# EAGLE design InstrDigitizer4 (EAGLE 8.5.2)

## Sheet 1 of 2
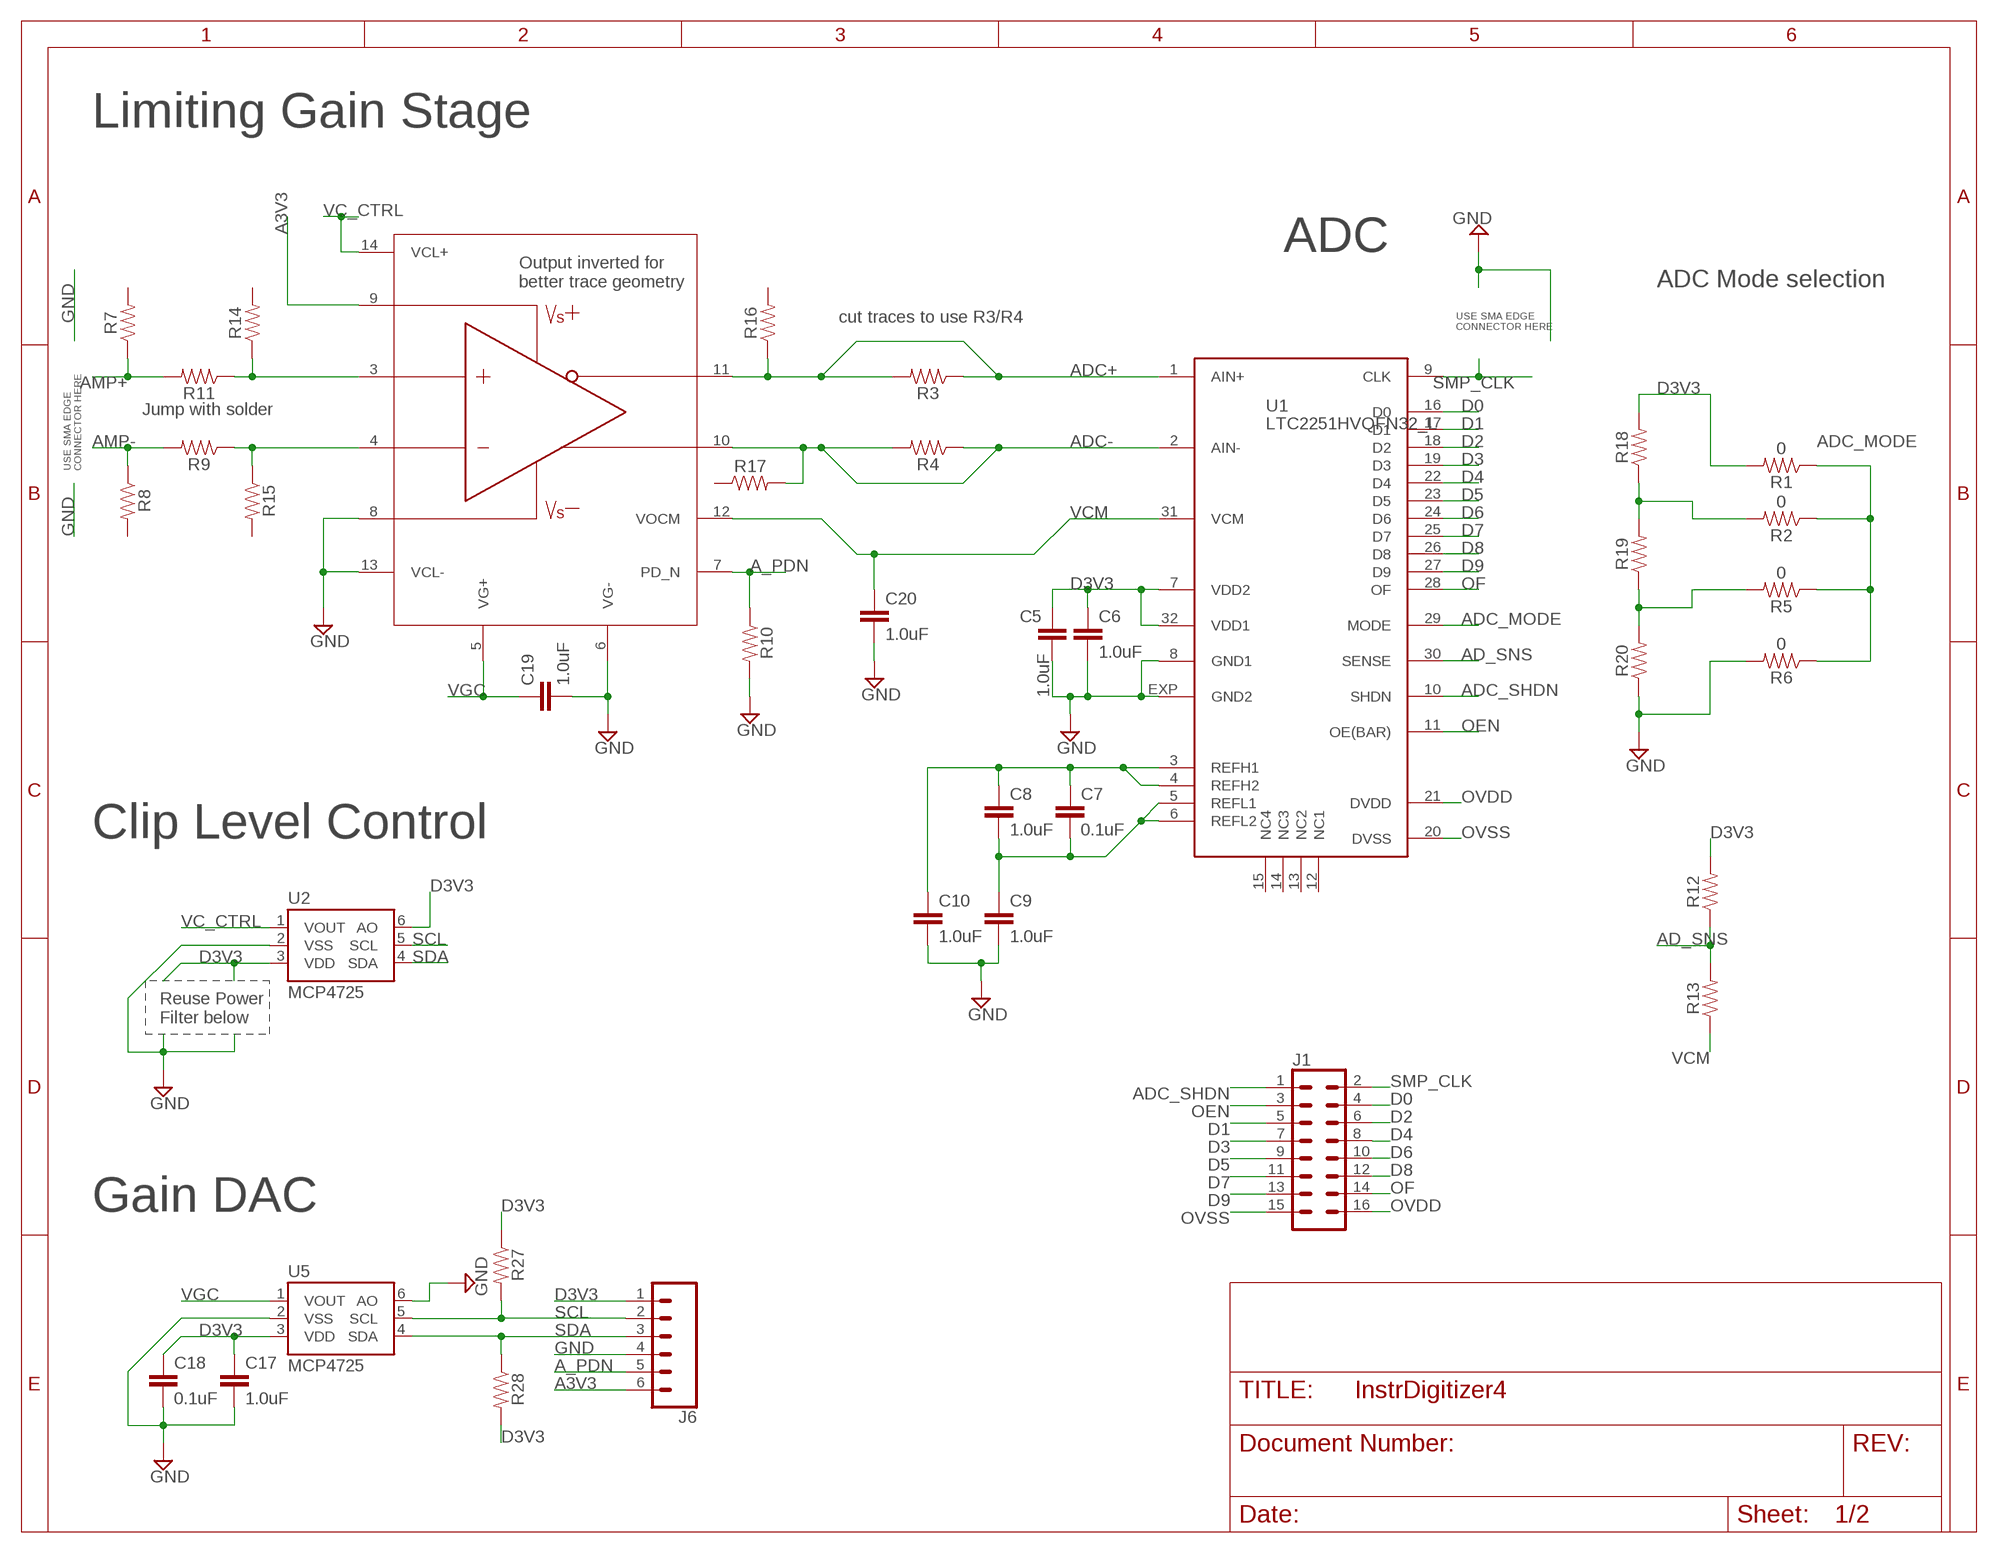
[diagram p0: schematic, sheet 1]

### Parts
C5  1.0uF  1.0UF-0402-16V-10%  [0402]
C6  1.0uF  1.0UF-0402-16V-10%  [0402]
C7  0.1uF  1.0UF-0402-16V-10%  [0402]
C8  1.0uF  1.0UF-0402-16V-10%  [0402]
C9  1.0uF  1.0UF-0402-16V-10%  [0402]
C10  1.0uF  1.0UF-0402-16V-10%  [0402]
C17  1.0uF  1.0UF-0402-16V-10%  [0402]
C18  0.1uF  0.1UF-0402-16V-10%  [0402]
C19  1.0uF  1.0UF-0402-16V-10%  [0402]
C20  1.0uF  1.0UF-0402-16V-10%  [0402]
J1  CONN_08X2  [2X8]
J6  CONN_06SILK_FEMALE_PTH  [1X06]
R1  0  RESISTOR0402  [0402]
R2  0  RESISTOR0402  [0402]
R3  RESISTOR0402  [0402]
R4  RESISTOR0402  [0402]
R5  0  RESISTOR0402  [0402]
R6  0  RESISTOR0402  [0402]
R7  RESISTOR0402  [0402]
R8  RESISTOR0402  [0402]
R9  RESISTOR0402  [0402]
R10  RESISTOR0402  [0402]
R11  RESISTOR0402  [0402]
R12  RESISTOR0402  [0402]
R13  RESISTOR0402  [0402]
R14  RESISTOR0402  [0402]
R15  RESISTOR0402  [0402]
R16  RESISTOR0402  [0402]
R17  RESISTOR0402  [0402]
R18  RESISTOR0402  [0402]
R19  RESISTOR0402  [0402]
R20  RESISTOR0402  [0402]
R27  RESISTOR0402  [0402]
R28  RESISTOR0402  [0402]
U1  LTC2251HVQFN32_L  [HVQFN32_LONG]
U2  MCP4725  MCP4725SOT-23  [SOT23-6]
U5  MCP4725  MCP4725SOT-23  [SOT23-6]
U$1  THS7530TSSOP14_LONG  [TSSOP14_LONG]

### Nets
A3V3: J6.6 U$1.9 ; also sheet 2
A_PDN: J6.5 R10.1 U$1.7(PD_N)
AD_SNS: R12.1 R13.2 U1.30(SENSE)
ADC+: R3.1 R3.2 R16.1 U1.1(AIN+) U$1.11(VO-)
ADC-: R4.1 R4.2 R17.2 U1.2(AIN-) U$1.10(VO+)
ADC_MODE: R1.1 R2.1 R5.1 R6.1 U1.29(MODE)
ADC_SHDN: J1.1 U1.10(SHDN)
AMP+: R7.1 R11.2
AMP-: R8.1 R9.2
D0: J1.4 U1.16(D0)
D1: J1.5 U1.17(D1)
D2: J1.6 U1.18(D2)
D3: J1.7 U1.19(D3)
D3V3: C5.1 C6.1 C17.1 C18.1 J6.1 R1.2 R12.2 R18.2 R27.1 R28.2 U1.7(VDD2) U1.32(VDD1) U2.3(VDD) U2.6(AO) U5.3(VDD) ; also sheet 2
D4: J1.8 U1.22(D4)
D5: J1.9 U1.23(D5)
D6: J1.10 U1.24(D6)
D7: J1.11 U1.25(D7)
D8: J1.12 U1.26(D8)
D9: J1.13 U1.27(D9)
GND: C5.2 C6.2 C9.2 C10.2 C17.2 C18.2 C19.2 C20.2 J6.4 R6.2 R10.2 R20.1 U1.8(GND1) U1.EXP(GND2) U2.2(VSS) U5.2(VSS) U5.6(AO) U$1.6(VG-) U$1.8 U$1.13(VCL-) ; also sheet 2
N$1: R11.1 R14.1 U$1.3
N$11: R9.1 R15.1 U$1.4
N$21: C7.1 C8.1 C10.1 U1.3(REFH1) U1.4(REFH2)
N$22: R5.2 R19.1 R20.2
N$23: C7.2 C8.2 C9.1 U1.5(REFL1) U1.6(REFL2)
N$30: R2.2 R18.1 R19.2
OEN: J1.3 U1.11(OE(BAR))
OF: J1.14 U1.28(OF)
OVDD: J1.16 U1.21(DVDD)
OVSS: J1.15 U1.20(DVSS)
SCL: J6.2 R27.2 U2.5(SCL) U5.5(SCL)
SDA: J6.3 R28.1 U2.4(SDA) U5.4(SDA)
SMP_CLK: J1.2 U1.9(CLK)
VC_CTRL: U2.1(VOUT) U$1.14(VCL+)
VCM: C20.1 R13.1 U1.31(VCM) U$1.12(VOCM)
VGC: C19.1 U5.1(VOUT) U$1.5(VG+)
Unconnected: R7.2 R8.2 R14.2 R15.2 R16.2 R17.1 U1.12(NC1) U1.13(NC2) U1.14(NC3) U1.15(NC4)

### Notes on the sheet
- Limiting Gain Stage
- ADC
- Output inverted for 
  better trace geometry
- ADC Mode selection
- cut traces to use R3/R4
- USE SMA EDGE 
  CONNECTOR HERE
- Jump with solder
- USE SMA EDGE 
  CONNECTOR HERE
- Clip Level Control
- Reuse Power
  Filter below
- Gain DAC

## Sheet 2 of 2
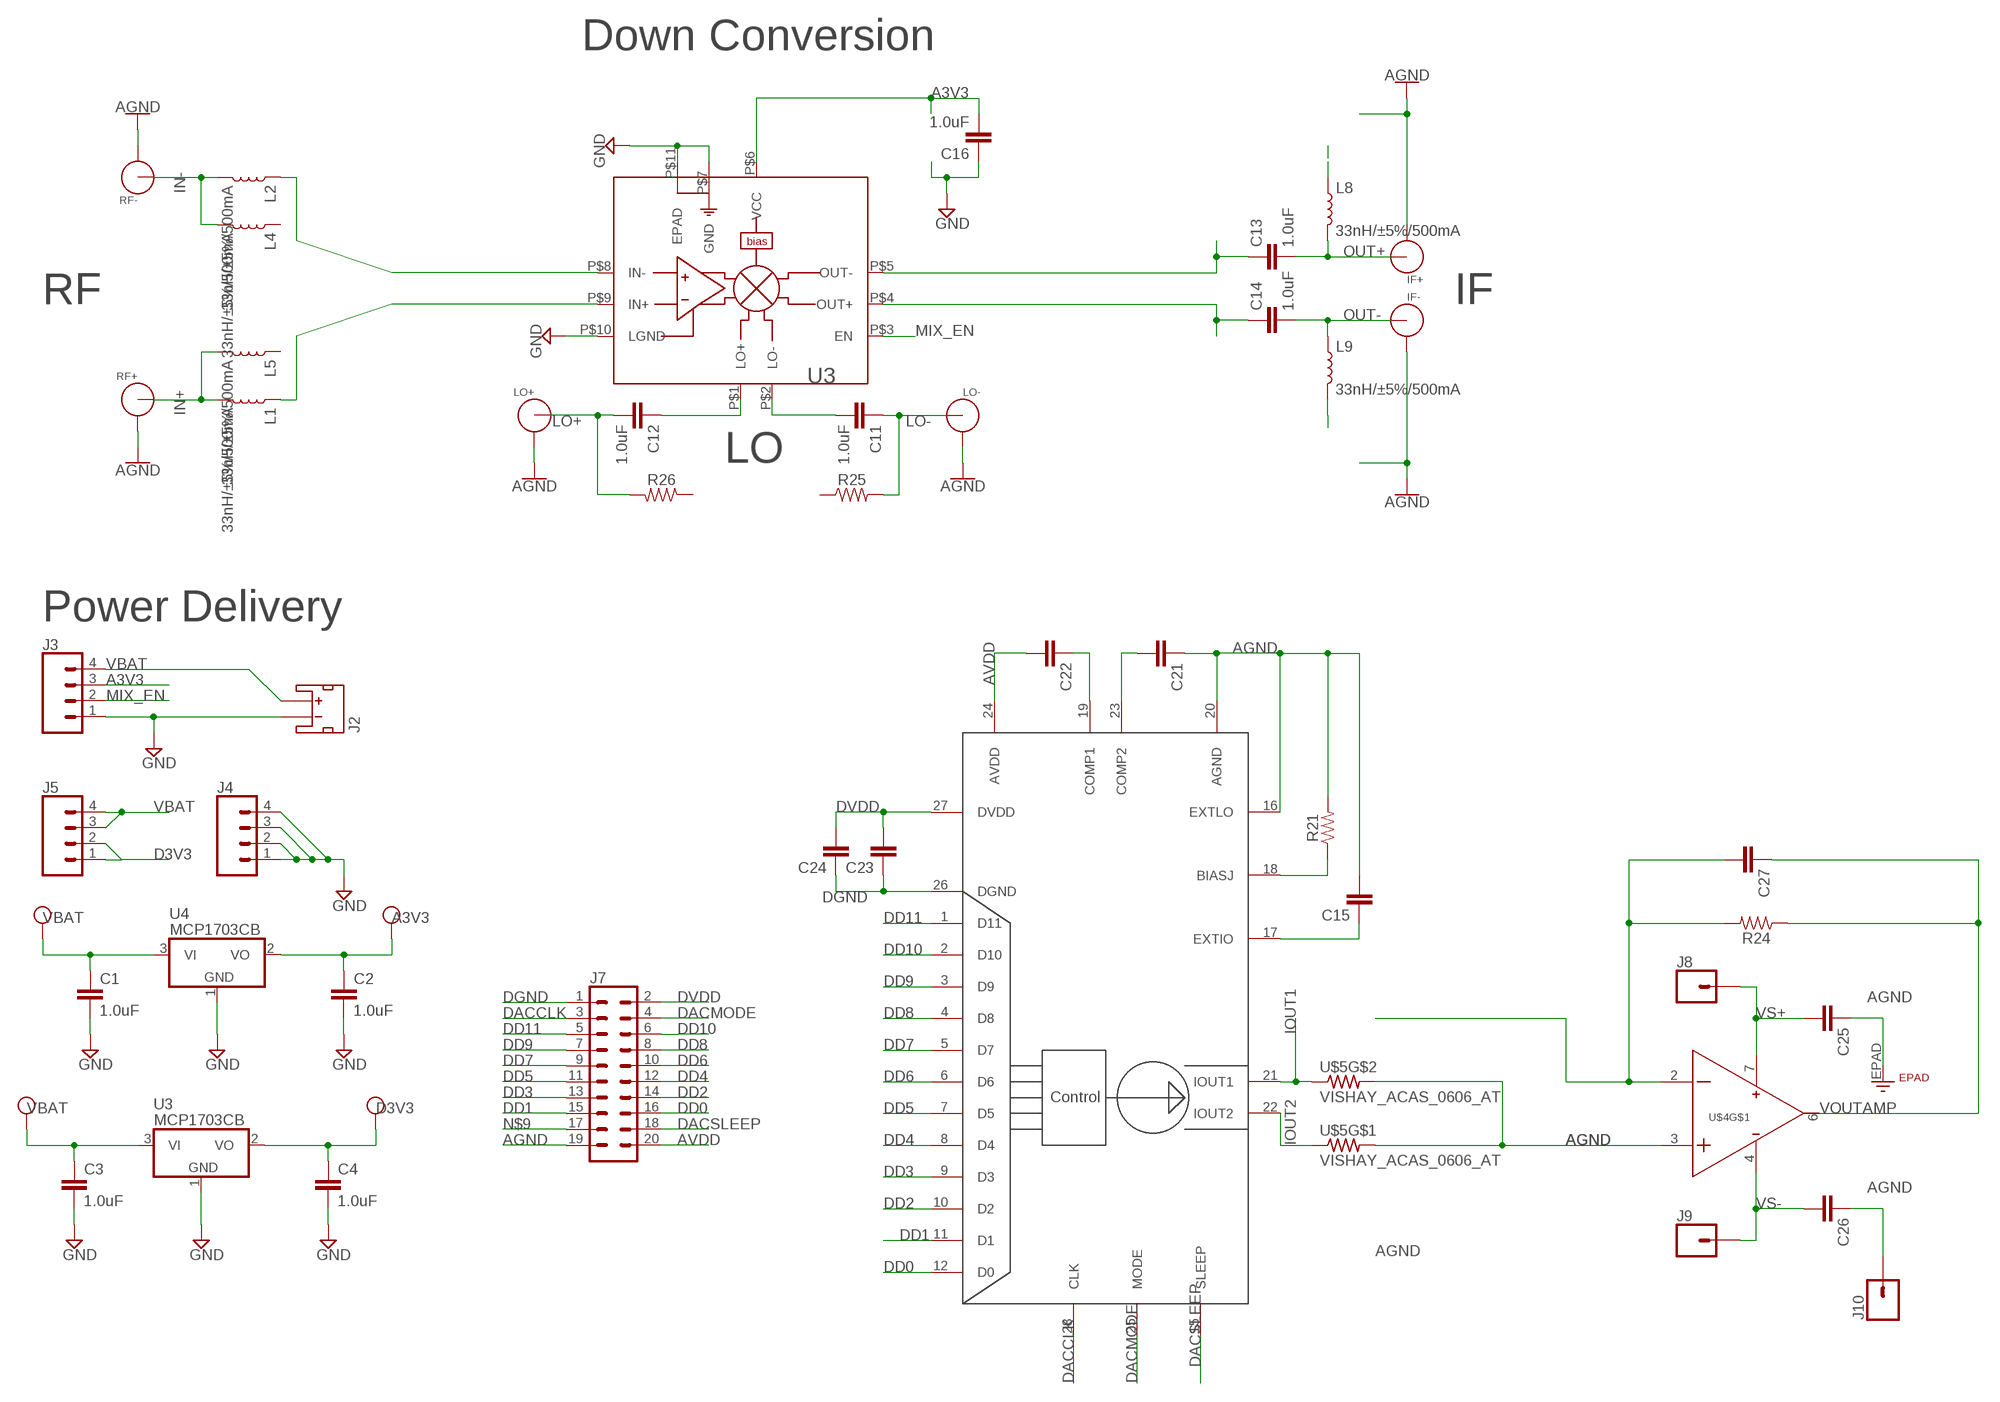
[diagram p1: schematic, sheet 2]

### Parts
C1  1.0uF  1.0UF-0402-16V-10%  [0402]
C2  1.0uF  1.0UF-0402-16V-10%  [0402]
C3  1.0uF  1.0UF-0402-16V-10%  [0402]
C4  1.0uF  1.0UF-0402-16V-10%  [0402]
C11  1.0uF  1.0UF-0402-16V-10%  [0402]
C12  1.0uF  1.0UF-0402-16V-10%  [0402]
C13  1.0uF  1.0UF-0402-16V-10%  [0402]
C14  1.0uF  1.0UF-0402-16V-10%  [0402]
C15  1.0UF-0402-16V-10%  [0402]
C16  1.0uF  1.0UF-0402-16V-10%  [0402]
C21  1.0UF-0402-16V-10%  [0402]
C22  1.0UF-0402-16V-10%  [0402]
C23  1.0UF-0402-16V-10%  [0402]
C24  1.0UF-0402-16V-10%  [0402]
C25  1.0UF-0402-16V-10%  [0402]
C26  1.0UF-0402-16V-10%  [0402]
C27  1.0UF-0402-16V-10%  [0402]
IF+  LINX-SMA-EDGE-0.062  [CONSMA003.062]
IF-  LINX-SMA-EDGE-0.062  [CONSMA003.062]
J2  JST_2MM_MALE  [JST-2-SMD]
J3  CONN_04  [1X04]
J4  CONN_04  [1X04]
J5  CONN_04  [1X04]
J7  CONN_10X2  [2X10]
J8  CONN_01  [1X01]
J9  CONN_01  [1X01]
J10  CONN_01  [1X01]
L1  33nH/±5%/500mA  INDUCTOR-0603-33NH  [0603]
L2  33nH/±5%/500mA  INDUCTOR-0603-33NH  [0603]
L4  33nH/±5%/500mA  INDUCTOR-0603-33NH  [0603]
L5  33nH/±5%/500mA  INDUCTOR-0603-33NH  [0603]
L8  33nH/±5%/500mA  INDUCTOR-0603-33NH  [0603]
L9  33nH/±5%/500mA  INDUCTOR-0603-33NH  [0603]
LO+  LINX-SMA-EDGE-0.062  [CONSMA003.062]
LO-  LINX-SMA-EDGE-0.062  [CONSMA003.062]
R21  RESISTOR0402  [0402]
R24  RESISTOR0402  [0402]
R25  RESISTOR0402  [0402]
R26  RESISTOR0402  [0402]
RF+  LINX-SMA-EDGE-0.062  [CONSMA003.062]
RF-  LINX-SMA-EDGE-0.062  [CONSMA003.062]
U3  MCP1703CB  [SOT23]
U4  MCP1703CB  [SOT23]
U$2  THS5661ASOIC28  [SOIC-28]
U$3  LTC5562LONG  [QFN_10_2X2MM_05-08-1534_LONG]
U$4  THS4011SOIC8-EPAD  [SO-08]
U$5  VISHAY_ACAS_0606_AT  [VISHAY_ACAS0606AT]

### Nets
A3V3: C2.1 C16.2 J3.3 U4.2(VO) U$3.P$6(VCC) ; supply symbol labelled VDD ; also sheet 1
AGND: C15.2 C21.1 C25.1 C26.1 J7.19 J10.1 R21.2 U$2.16(EXTLO) U$2.20(AGND) U$4.3(IN+) U$4.EPAD U$5.P$3 U$5.P$4
AVDD: C22.2 J7.20 U$2.24(AVDD)
D3V3: C4.1 J5.1 J5.2 U3.2(VO) ; supply symbol labelled VDD ; also sheet 1
DACCLK: J7.3 U$2.28(CLK)
DACMODE: J7.4 U$2.25(MODE)
DACSLEEP: J7.18 U$2.15(SLEEP)
DD0: J7.16 U$2.12(D0)
DD1: J7.15 U$2.11(D1)
DD2: J7.14 U$2.10(D2)
DD3: J7.13 U$2.9(D3)
DD4: J7.12 U$2.8(D4)
DD5: J7.11 U$2.7(D5)
DD6: J7.10 U$2.6(D6)
DD7: J7.9 U$2.5(D7)
DD8: J7.8 U$2.4(D8)
DD9: J7.7 U$2.3(D9)
DD10: J7.6 U$2.2(D10)
DD11: J7.5 U$2.1(D11)
DGND: C23.1 C24.1 J7.1 U$2.26(DGND)
DVDD: C23.2 C24.2 J7.2 U$2.27(DVDD)
GND: C1.2 C2.2 C3.2 C4.2 C16.1 IF+.GND1 IF+.GND2 IF+.GND3 IF+.GND4 IF-.GND1 IF-.GND2 IF-.GND3 IF-.GND4 J2.1(-) J3.1 J4.1 J4.2 J4.3 J4.4 LO+.GND1 LO+.GND2 LO+.GND3 LO+.GND4 LO-.GND1 LO-.GND2 LO-.GND3 LO-.GND4 RF+.GND1 RF+.GND2 RF+.GND3 RF+.GND4 RF-.GND1 RF-.GND2 RF-.GND3 RF-.GND4 U3.1(GND) U4.1(GND) U$3.P$7(GND) U$3.P$10(LGND) U$3.P$11(EPAD) ; supply symbol labelled AGND ; also sheet 1
IN+: L1.2 L5.2 RF+.ANT
IN-: L2.2 L4.2 RF-.ANT
IOUT1: U$2.21(IOUT1) U$5.P$2
IOUT2: U$2.22(IOUT2) U$5.P$1
LO+: C12.2 LO+.ANT R26.2
LO-: C11.1 LO-.ANT R25.2
MIX_EN: J3.2 U$3.P$3(EN)
N98: L1.1 U$3.P$9(IN+)
N$3: C15.1 U$2.17(EXTIO)
N$4: R21.1 U$2.18(BIASJ)
N$6: C21.2 U$2.23(COMP2)
N$7: C22.1 U$2.19(COMP1)
N$8: C27.2 R24.2 U$4.2(IN-)
N$9: J7.17
N$20: C11.2 U$3.P$2(LO-)
N$24: C12.1 U$3.P$1(LO+)
N$25: L2.1 U$3.P$8(IN-)
N$26: C14.1 U$3.P$4(OUT+)
N$27: C13.1 U$3.P$5(OUT-)
N$37: L8.1
N$38: L9.2
OUT+: C13.2 IF+.ANT L8.2
OUT-: C14.2 IF-.ANT L9.1
VBAT: C1.1 C3.1 J2.2(+) J3.4 J5.3 J5.4 U3.3(VI) U4.3(VI) ; supply symbol labelled VCC
VOUTAMP: C27.1 R24.1 U$4.6(OUT)
VS+: C25.2 J8.1 U$4.7(VCC+)
VS-: C26.2 J9.1 U$4.4(VCC-)
Unconnected: J2.NC1(PAD1) J2.NC2(PAD2) L4.1 L5.1 R25.1 R26.1

### Notes on the sheet
- Down Conversion
- RF | IF
- U3
- LO
- Power Delivery

## Library data of the parts
C1-C6 C8-C14 C16 C17 C19 C20 = SparkFun-Capacitors:1.0UF: 1µF ceramic capacitors A capacitor is a passive two-terminal electrical component used to store electrical energy temporarily in an electric field.; PROD_ID: CAP-12417
C7 C15 C21-C27 = SparkFun-Capacitors:1.0UF: 1µF ceramic capacitors A capacitor is a passive two-terminal electrical component used to store electrical energy temporarily in an electric field.; PROD_ID: CAP-12417; VALUE: 1.0uF
C18 = SparkFun-Capacitors:0.1UF: 0.1µF ceramic capacitors A capacitor is a passive two-terminal electrical component used to store electrical energy temporarily in an electric field.; PROD_ID: CAP-12416
IF+ IF- LO+ LO- RF+ RF- = connector:LINX-SMA-EDGE-0.062: CONN SMA JACK 50 OHM EDGE MNT; DIGIKEY: CONSMA003.062-ND
J1 = SparkFun-Connectors:CONN_08X2: Multi connection point. Often used as Generic Header-pin footprint for 0.1 inch spaced/style header connections You can populate with any combo of single row headers, but if you'd like an exact match, check this: Header - 2x8 (Male, 0.1") <https://www.sparkfun.com/products/13156> (PRT-13156) On any of the 0.1 inch spaced packages, you can populate with these: Break Away Headers - Straight <https://www.sparkfun.com/products/116> (PRT-00116) Break Away Male Headers - Right Angle <https://www.sparkfun.com/products/553> (PRT-00553) Female Headers <https://www.sparkfun.com/products/115> (PRT-00115) Break Away Headers - Machine Pin <https://www.sparkfun.com/products/117> (PRT-00117) Break Away Female Headers - Swiss Machine Pin <https://www.sparkfun.com/products/743> (PRT-00743)
J2 = SparkFun-Connectors:JST_2MM_MALE: JST 2MM MALE RA CONNECTOR Two pin, compact surface mount connector. Commonly used as a battery input connection point. We really like the solid locking feeling and high current rating on these small connectors. We use these all the time as battery connectors. Mates to single-cell LiPo batteries. Here is the connector we sell at SparkFun: JST Right Angle Connector - White <https://www.sparkfun.com/products/8612> (PRT-08612) Datasheet <http://www.sparkfun.com/datasheets/Prototyping/Connectors/JST-Horizontal.pdf> It was used on these SparkFun products: SparkFun MOSFET Power Controller <https://www.sparkfun.com/products/11214> (PRT-11214) SparkFun Battery Babysitter - LiPo Battery Manager <https://www.sparkfun.com/products/13777> (PRT-13777) And many, many others that required a lipo battery connection.; PROD_ID: CONN-11443; SF_ID: PRT-08612
J3-J5 = SparkFun-Connectors:CONN_04: Multi connection point. Often used as Generic Header-pin footprint for 0.1 inch spaced/style header connections On any of the 0.1 inch spaced packages, you can populate with these: Break Away Headers - Straight <https://www.sparkfun.com/products/116> (PRT-00116) Break Away Male Headers - Right Angle <https://www.sparkfun.com/products/553> (PRT-00553) Female Headers <https://www.sparkfun.com/products/115> (PRT-00115) Break Away Headers - Machine Pin <https://www.sparkfun.com/products/117> (PRT-00117) Break Away Female Headers - Swiss Machine Pin <https://www.sparkfun.com/products/743> (PRT-00743) For SCREWTERMINALS and SPRING TERMINALS visit here: Screw Terimnals on SparkFun.com <https://www.sparkfun.com/search/results?term=Screw+Terminals> (5mm/3.5mm/2.54mm spacing) This device is also useful as a general connection point to wire up your design to another part of your project. Our various solder wires solder well into these plated through hole pads. Hook-Up Wire - Assortment (Stranded, 22 AWG) <https://www.sparkfun.com/products/11375> (PRT-11375) Hook-Up Wire - Assortment (Solid Core, 22 AWG) <https://www.sparkfun.com/products/11367> (PRT-11367) View the entire wire category on our website here <https://www.sparkfun.com/categories/141> Special notes: Molex polarized connector foot print use with SKU : PRT-08231 with associated crimp pins and housings. 1MM SMD Version SKU: PRT-10208; PROD_ID: CONN-09696
J6 = SparkFun-Connectors:CONN_06: Multi connection point. Often used as Generic Header-pin footprint for 0.1 inch spaced/style header connections On any of the 0.1 inch spaced packages, you can populate with these: Break Away Headers - Straight <https://www.sparkfun.com/products/116> (PRT-00116) Break Away Male Headers - Right Angle <https://www.sparkfun.com/products/553> (PRT-00553) Female Headers <https://www.sparkfun.com/products/115> (PRT-00115) Break Away Headers - Machine Pin <https://www.sparkfun.com/products/117> (PRT-00117) Break Away Female Headers - Swiss Machine Pin <https://www.sparkfun.com/products/743> (PRT-00743) Arduino Stackable Header - 6 Pin <https://www.sparkfun.com/products/9280> (PRT-09280) For SCREWTERMINALS and SPRING TERMINALS visit here: Screw Terimnals on SparkFun.com <https://www.sparkfun.com/search/results?term=Screw+Terminals> (5mm/3.5mm/2.54mm spacing) This device is also useful as a general connection point to wire up your design to another part of your project. Our various solder wires solder well into these plated through hole pads. Hook-Up Wire - Assortment (Stranded, 22 AWG) <https://www.sparkfun.com/products/11375> (PRT-11375) Hook-Up Wire - Assortment (Solid Core, 22 AWG) <https://www.sparkfun.com/products/11367> (PRT-11367) View the entire wire category on our website here <https://www.sparkfun.com/categories/141>; PROD_ID: CONN-08437
J7 = SparkFun-Connectors:CONN_10X2: Multi connection point. Often used as Generic Header-pin footprint for 0.1 inch spaced/style header connections On any of the 0.1 inch spaced packages, you can populate with these: Break Away Headers - Straight <https://www.sparkfun.com/products/116> (PRT-00116) Break Away Male Headers - Right Angle <https://www.sparkfun.com/products/553> (PRT-00553) Female Headers <https://www.sparkfun.com/products/115> (PRT-00115) Break Away Headers - Machine Pin <https://www.sparkfun.com/products/117> (PRT-00117) Break Away Female Headers - Swiss Machine Pin <https://www.sparkfun.com/products/743> (PRT-00743) Special note about the "SPECIAL" package: This was SPECIALLY designed to be used with our Graphic LCD Backpack. Be sure you want to use this! It is not only staggered on each line of header holes, but IT IS ALSO offset of the center point of the top and bottom lines by 5 mil. This causes the headers to lock into place on the "standard" footprint on the LCD screen. The extra squares on the tdocu layer are there simply to reference other pins (if you were to actually populate a longer header than ten long - this is what we do with the backpacks).
J8-J10 = SparkFun-Connectors:CONN_01: Single connection point. Often used as Generic Header-pin footprint for 0.1 inch spaced/style header connections On any of the 0.1 inch spaced packages, you can populate with these: Break Away Headers - Straight <https://www.sparkfun.com/products/116> (PRT-00116) Break Away Male Headers - Right Angle <https://www.sparkfun.com/products/553> (PRT-00553) Female Headers <https://www.sparkfun.com/products/115> (PRT-00115) Break Away Headers - Machine Pin <https://www.sparkfun.com/products/117> (PRT-00117) Break Away Female Headers - Swiss Machine Pin <https://www.sparkfun.com/products/743> (PRT-00743) This device is also useful as a general connection point to wire up your design to another part of your project. Our various solder wires solder well into these plated through hole pads. Hook-Up Wire - Assortment (Stranded, 22 AWG) <https://www.sparkfun.com/products/11375> (PRT-11375) Hook-Up Wire - Assortment (Solid Core, 22 AWG) <https://www.sparkfun.com/products/11367> (PRT-11367) View the entire wire category on our website here <https://www.sparkfun.com/categories/141> Special notes: SMTSO-256-ET is a "flush mount" nut for a 4-40 screw. We mostly use this on specialty testbeds; it is a nice way to connect hardware to your PCB at an adjustable hieght. Also note, the SNAP packages are for using a snappable style connector. We sell a baggie of snaps and they are also used on two LilyPad designs: Snap Assortment - 30 pack (male and female) <https://www.sparkfun.com/products/11347> (DEV-11347) LilyPad Arduino SimpleSnap <https://www.sparkfun.com/products/10941> (DEV-10941) LilyPad SimpleSnap Protoboard <https://www.sparkfun.com/products/10940> (DEV-10940)
L1 L2 L4 L5 L8 L9 = SparkFun-Coils:INDUCTOR: Inductors Resist changes in electrical current. Basically a coil of wire. SparkFun Products: SparkFun Load Cell Amplifier - HX711 <https://www.sparkfun.com/products/13879> IOIO-OTG - V2.2 <https://www.sparkfun.com/products/13613>; PROD_ID: NDUC-07874
R1-R21 R24-R28 = SparkFun-Resistors:RESISTOR: Generic Resistor Package
U1 = components:LTC2251: LTC2251 125MSPS Pipelined ADC
U2 U5 = SparkFun-IC-Conversion:MCP4725: MCP4725 DAC Microchip 12-bit I2C DAC, SOT23-6 Datasheet <https://cdn.sparkfun.com/datasheets/BreakoutBoards/MCP4725_2009.pdf> SparkFun Products SparkFun I2C DAC Breakout - MCP4725 <https://www.sparkfun.com/products/12918> (BOB-12918); PROD_ID: IC-08886
U3 U4 = linear:MCP1703: 250 mA, 16V, Low Quiescent Current LDO Regulator Source: http://ww1.microchip.com/downloads/en/DeviceDoc/22049b.pdf
U$1 = components:THS7530
U$2 = components:THS5661A
U$3 = components:LTC5562: LF–7GHz Wideband Low Power Active Mixer Wideband Frequency Range to 7GHz Low Power: 2.7V to 3.6V, 40mA Supply Supply Current Adjustable Down to 15mA Up or Downconversion OIP3: +20dBm at 3.6GHz Out Conversion Gain: +1dB Low LO Drive: –4dBm to +2dBm LO Impedance Match Maintained During Shutdown Enable Control, 10μA Shutdown Current 2kV ESD (HBM and CDM) –40°C to 105°C Operation Small 2mm × 2mm 10-Lead QFN Package
U$4 = components:THS4011
U$5 = components:VISHAY_ACAS_0606_AT

## Board
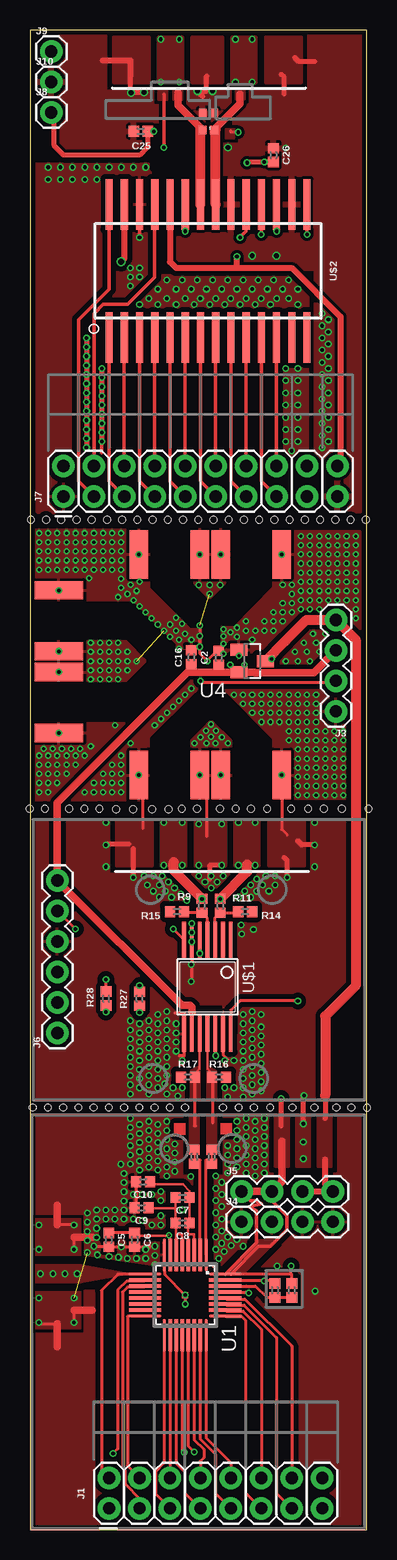
[diagram p2: board, top side]
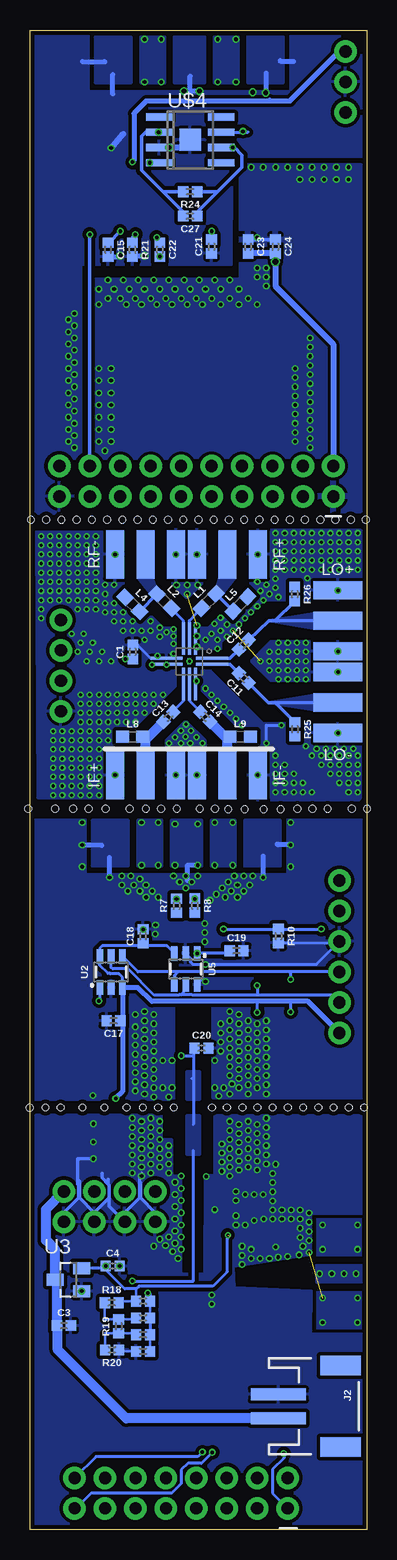
[diagram p3: board, bottom side, seen from below]

Size 28.11 x 124.98 mm. Coordinates in mm from the lower left corner, seen from the top.
Outline: 0,0 28.11,0 28.11,124.98 0,124.98 0,0
Copper layers (1*16): Top 0.0356mm / dielectric 60mil / Bottom 0.0356mm
Design rules "OSHPARK": minimum track width 6mil, minimum drill 10mil, track to track 6mil, track to pad 6mil, pad to pad 6mil, via to via 6mil, smd to smd 0mil, copper to edge 15mil, drill to drill 10mil, minimum pad ring 5mil, minimum via ring 5mil, stop-mask expansion 4mil, vias tented up to drill 20mil, thermal gap 10mil
Holes 0.55 mm at 16.1,35.18 18.69,35.18 12.93,35.18 11.66,35.18 10.39,35.18 9.12,35.18 26.82,35.18 7.85,35.18 6.58,35.18 5.31,35.18 25.55,35.18 23.72,35.18 21.89,35.18 20.04,35.18 28.12,35.15 8.61,60.05 17.42,35.18 4.04,35.18 2.77,35.18 1.5,35.18 0.23,35.18 15.85,60.07 18.44,60.07 13.94,60.07 11.56,60.05 10.19,60.05 5.79,60.07 4.55,60.07 3.28,60.07 24.51,60.07 23.22,60.07 21.79,60.07 19.79,60.07 26.01,60.07 17.17,60.07 7.19,60.05 1.24,60.07 -0.03,60.07 28.24,60.07 12.67,60.07 8.97,84.18 7.7,84.18 6.43,84.18 5.16,84.18 3.89,84.18 2.62,84.18 1.35,84.18 0.08,84.18 19.13,84.18 17.86,84.18 16.59,84.18 15.32,84.18 14.05,84.18 12.78,84.18 11.51,84.18 10.24,84.18 28.02,84.18 26.75,84.18 25.48,84.18 24.21,84.18 22.94,84.18 21.67,84.18 20.4,84.18

### Footprints (pad centres in the part's own frame; a part is rotated, then mirrored left to right if it is on the bottom)
0402 = smd 0.85 x 0.9: 1 -0.58,0; 2 0.58,0
CONSMA003.062 = smd 4.06 x 1.52: ANT 0,0; GND1 0,2.54; GND2 0,-2.54 | smd 4.06 x 1.52 bottom: GND3 0,2.54; GND4 0,-2.54
2X8 = drill 1.016 pad 1.88: 1 0,0; 2 0,2.54; 3 2.54,0; 4 2.54,2.54; 5 5.08,0; 6 5.08,2.54; 7 7.62,0; 8 7.62,2.54; 9 10.16,0; 10 10.16,2.54; 11 12.7,0; 12 12.7,2.54; 13 15.24,0; 14 15.24,2.54; 15 17.78,0; 16 17.78,2.54
JST-2-SMD = smd 1 x 4.6: 1 -1,-3.7; 2 1,-3.7 | smd 1.6 x 3.4: NC1 -3.4,1.5; NC2 3.4,1.5
1X04 = drill 1.016 pad 1.88: 1 0,0; 2 2.54,0; 3 5.08,0; 4 7.62,0
1X06 = drill 1.016 pad 1.88: 1 0,0; 2 2.54,0; 3 5.08,0; 4 7.62,0; 5 10.16,0; 6 12.7,0
2X10 = drill 1.016 pad 1.88: 1 0,0; 2 0,2.54; 3 2.54,0; 4 2.54,2.54; 5 5.08,0; 6 5.08,2.54; 7 7.62,0; 8 7.62,2.54; 9 10.16,0; 10 10.16,2.54; 11 12.7,0; 12 12.7,2.54; 13 15.24,0; 14 15.24,2.54; 15 17.78,0; 16 17.78,2.54; 17 20.32,0; 18 20.32,2.54; 19 22.86,0; 20 22.86,2.54
1X01 = drill 1.016 pad 1.88: 1 0,0
0603 = smd 1.1 x 1: 1 -0.85,0; 2 0.85,0
HVQFN32_LONG = smd 2.7 x 0.28: 1 -3.35,1.75; 2 -3.35,1.25; 3 -3.35,0.75; 4 -3.35,0.25; 5 -3.35,-0.25; 6 -3.35,-0.75; 7 -3.35,-1.25; 8 -3.35,-1.75; 17 3.35,-1.75; 18 3.35,-1.25; 19 3.35,-0.75; 20 3.35,-0.25; 21 3.35,0.25; 22 3.35,0.75; 23 3.35,1.25; 24 3.35,1.75 | smd 0.28 x 2.7: 9 -1.75,-3.35; 10 -1.25,-3.35; 11 -0.75,-3.35; 12 -0.25,-3.35; 13 0.25,-3.35; 14 0.75,-3.35; 15 1.25,-3.35; 16 1.75,-3.35; 25 1.75,3.35; 26 1.25,3.35; 27 0.75,3.35; 28 0.25,3.35; 29 -0.25,3.35; 30 -0.75,3.35; 31 -1.25,3.35; 32 -1.75,3.35 | smd 0.5 x 0.5: EXP 0,0 | smd 0.25 x 0.25: M1 -2.415,2.415
SOT23-6 = smd 0.55 x 1.2: 1 0.95,1.3; 2 0,1.3; 3 -0.95,1.3; 4 -0.95,-1.3; 5 0,-1.3; 6 0.95,-1.3
SOT23 = smd 1 x 1.4: 1 -0.95,-1.1; 2 0.95,-1.1; 3 0,1.1
TSSOP14_LONG = smd 0.305 x 3: 1 -1.95,-3.918; 2 -1.3,-3.918; 3 -0.65,-3.918; 4 0,-3.918; 5 0.65,-3.918; 6 1.3,-3.918; 7 1.95,-3.918; 8 1.95,3.918; 9 1.3,3.918; 10 0.65,3.918; 11 0,3.918; 12 -0.65,3.918; 13 -1.3,3.918; 14 -1.95,3.918
SOIC-28 = smd 0.6 x 4.2: 1 8.89,5.548; 2 7.62,5.548; 3 6.35,5.548; 4 5.08,5.548; 5 3.81,5.548; 6 2.54,5.548; 7 1.27,5.548; 8 0,5.548; 9 -1.27,5.548; 10 -2.54,5.548; 11 -3.81,5.548; 12 -5.08,5.548; 13 -6.35,5.548; 14 -7.62,5.548; 15 -7.62,-5.548; 16 -6.35,-5.548; 17 -5.08,-5.548; 18 -3.81,-5.548; 19 -2.54,-5.548; 20 -1.27,-5.548; 21 0,-5.548; 22 1.27,-5.548; 23 2.54,-5.548; 24 3.81,-5.548; 25 5.08,-5.548; 26 6.35,-5.548; 27 7.62,-5.548; 28 8.89,-5.548
QFN_10_2X2MM_05-08-1534_LONG = smd 0.25 x 2.7: P$1 -0.25,1.9; P$2 0.25,1.9; P$6 0.25,-1.9; P$7 -0.25,-1.9 | smd 2.7 x 0.25: P$3 1.9,0.5; P$4 1.9,0; P$5 1.9,-0.5; P$8 -1.9,-0.5; P$9 -1.9,0; P$10 -1.9,0.5 | smd 0.5 x 0.3: P$11 0,0
SO-08 = smd 0.6 x 2.2: 1 -1.905,-2.6; 2 -0.635,-2.6; 3 0.635,-2.6; 4 1.905,-2.6; 5 1.905,2.6; 6 0.635,2.6; 7 -0.635,2.6; 8 -1.905,2.6 | smd 1.829 x 1.829: EPAD 0,0
VISHAY_ACAS0606AT = smd 0.64 x 0.7: P$1 -0.47,-0.7; P$2 0.47,-0.7; P$3 0.47,0.7; P$4 -0.47,0.7

### Placement (x,y rotation side)
C1  19.52,73.15 90 bottom
C2  15.75,72.67 90 top
C3  25.27,17.02 0 bottom
C4  21.21,21.97 0 bottom
C5  6.58,24.15 270 top
C6  8.74,24.15 270 top
C7  12.73,27.68 180 top
C8  12.73,25.56 180 top
C9  9.3,26.83 180 top
C10  9.43,28.99 180 top
C11  10.26,70.97 135 bottom
C12  10.26,73.76 45 bottom
C13  16.56,67.74 225 bottom
C14  13.49,67.74 315 bottom
C15  21.59,106.68 270 bottom
C16  13.46,72.72 270 top
C17  21.14,42.42 180 bottom
C18  18.67,49.46 90 bottom
C19  10.87,48.26 0 bottom
C20  13.79,40.13 0 bottom
C21  12.95,106.93 90 bottom
C22  17.27,106.68 270 bottom
C23  9.91,106.93 270 bottom
C24  7.62,106.93 270 bottom
C25  9.25,116.54 0 top
C26  20.32,114.55 270 top
C27  14.73,109.47 180 bottom
IF+  18.47,62.89 90 bottom
IF-  11.63,62.89 270 bottom
J1  6.6,1.78 0 top
J2  3.68,10.29 270 bottom
J3  25.53,68.2 90 top
J4  17.65,25.65 0 top
J5  17.65,28.19 0 top
J6  2.29,41.4 90 top
J7  2.79,86.11 0 top
J8  1.78,118.11 0 top
J9  1.78,123.19 0 top
J10  1.78,120.65 0 top
L1  13.19,77.39 45 bottom
L2  16.89,77.38 135 bottom
L4  19.56,77.11 315 bottom
L5  10.54,77.14 225 bottom
L8  19.53,66.07 0 bottom
L9  10.57,66.09 0 bottom
LO+  2.41,75.74 0 bottom
LO-  2.41,68.94 180 bottom
R1  18.67,19.05 180 bottom
R2  18.67,17.65 180 bottom
R3  15.16,31.09 270 top
R4  13.72,31.09 90 top
R5  18.67,16.26 180 bottom
R6  18.67,14.86 180 bottom
R7  15.88,51.99 270 bottom
R8  14.35,52.02 270 bottom
R9  14.35,52 90 top
R10  7.37,49.48 270 bottom
R11  15.88,52 90 top
R12  21.84,19.94 90 top
R13  20.45,19.94 270 top
R14  17.96,51.51 0 top
R15  12.27,51.51 180 top
R16  15.77,37.72 0 top
R17  13.18,37.72 0 top
R18  21.28,18.92 0 bottom
R19  20.7,16.95 90 bottom
R20  21.26,14.99 180 bottom
R21  19.56,106.68 270 bottom
R24  14.73,111.51 180 bottom
R25  5.99,66.7 90 bottom
R26  6.02,77.97 270 bottom
R27  9.14,44.25 90 top
R28  6.35,44.27 270 top
RF+  11.63,81.28 270 bottom
RF-  18.47,81.28 90 bottom
U1  12.95,19.56 270 top
U2  21.34,46.48 180 bottom
U3  24.89,20.83 90 bottom
U4  18.54,72.39 270 top
U5  15.11,46.74 0 bottom
U$1  14.81,45.24 180 top
U$2  15.49,104.9 180 top
U$3  14.81,72.36 270 bottom
U$4  14.73,115.82 270 bottom
U$5  14.88,117.35 0 top

### Tracks (layer width: path | path; a pad name or v marks a point on that pad's centre or on a via)
A3V3  (via drill 0.25)
  Top 0.254: 13.51,43.08 13.51,43.01 U$1.9 | C16.2 13.15,71.82 13.15,71.44 | v17.91,72.08 17.44,71.62 | 17.44,71.62 U4.2 | v16.71,72.08 17.17,71.62 17.44,71.62 | 15.75,71.44 C2.1
  Top 0.61: 13.51,43.08 13.51,43.56 13.34,43.69 12.7,43.69 J6.6 2.29,60.58 13.15,71.44 15.75,71.44 U4.2 18.75,71.44 18.75,71.43 23.68,71.43 J3.3
  Bottom 0.254: v16.71,72.08 U$3.P$6 17.88,72.11 v17.91,72.08
A_PDN  (via drill 0.3)
  Top 0.254: U$1.7 v11.96,50.05 | v3.79,50.05 J6.5
  Bottom 0.254: v11.96,50.05 R10.1 v3.79,50.05
AD_SNS
  Top 0.254: U1.30 18.03,20.31 18.81,20.31 19.76,19.36 R13.2 R12.1
ADC+
  Top 0.152: R3.1 R3.2
  Top 0.203: U$1.11 14.81,38.41 15.24,37.97 | 15.24,31.75 R3.1
  Top 0.254: U1.1 14.7,30.81 R3.2 | 15.24,37.97 15.24,33.91
  pour Top (no thermals): 14.81,31.75 15.52,31.75 15.52,34.54 14.81,34.54
  pour Top (no thermals): 14.81,35.81 15.52,35.81 15.52,38.23 14.81,38.61
ADC-
  Top 0.152: R4.2 R4.1
  Top 0.203: U$1.10 14.16,38.41 13.72,37.97
  Top 0.254: U1.2 14.2,30.81 R4.1 | 13.72,37.97 13.72,33.66 13.84,33.66
  pour Top (no thermals): 13.36,31.75 14.07,31.75 14.07,34.54 13.36,34.54
  pour Top (no thermals): 13.44,35.84 14.15,35.84 14.15,38.63 13.44,38.25
ADC_MODE  (via drill 0.3)
  Top 0.254: U1.29 18,19.81 v18.26,19.72
  Bottom 0.203: R2.1 R1.1 | R6.1 R5.1
  Bottom 0.254: v18.26,19.72 18.09,19.72 R1.1 | R2.1 R5.1
ADC_SHDN  (via drill 0.3)
  Top 0.254: U1.10 9.52,20.73 8.06,20.73 7.32,19.98 7.32,6.73 v6.93,6.35
  Bottom 0.254: v6.93,6.35 6.93,5.97 7.87,5.03 7.87,3.05 J1.1
AGND  (via drill 0.3, 0.4)
  Top 0.406: 8.38,119.63 8.38,121.16 8.38,122.05 | 23.75,122.35 22.43,122.35 22.1,122.68 | 21.21,119.63 21.21,121.03 20.95,121.28 | v8.43,119.76 8.46,119.79 v9.53,119.79 | 14.41,119.44 v13.97,119.89 14.73,119.89 14.73,121.16
  Top 0.508: 8.38,121.16 8.38,122.43 6.1,122.43
  Bottom 0.406: 6.1,122.35 7.16,122.35 7.24,122.43 | 8.38,119.63 8.38,119.89 | 8.38,119.89 8.38,121.41 | 21.21,119.63 21.21,121.28 | 23.75,122.35 21.89,122.35 21.84,122.3 | U$4.3 v16.51,115.19 | 8.38,119.89 8.43,119.84 v8.43,119.76 | v13.97,119.89 v15.24,119.89 14.73,119.89 14.73,121.16 | R21.2 19.49,106.17 v18.54,106.17 | C15.2 20.65,106.1 v20.57,106.17
  Bottom 0.508: v16.51,115.19 15.37,115.19 U$4.EPAD | v21.34,115.13 20.32,116.33
  other vias: 24.38,101.35 24.38,100.33 24.38,99.31 24.38,98.3 24.38,97.28 24.38,96.27 24.38,95.25 24.38,94.23 24.38,93.22 24.38,92.2 24.38,91.19 24.38,90.17 24.89,100.84 24.89,99.82 24.89,98.81 24.89,97.79 24.89,96.77 24.89,95.76 24.89,94.74 24.89,93.73 24.89,92.71 24.89,91.69 24.89,90.68
  pour Bottom (isolate 0.305): 6.99,124.43 6.99,120.55 9.93,120.55 9.93,124.43
  pour Top (isolate 0.406): 9.93,124.43 9.93,120.55 6.99,120.55 6.99,124.43
  pour Top (isolate 0.406): 22.63,124.43 22.63,120.55 19.68,120.55 19.68,124.43
  pour Bottom (isolate 0.406): 19.68,124.43 19.68,120.55 22.63,120.55 22.63,124.43
  pour Bottom (isolate 0.305, rank 2): 0,124.46 -0.03,114.43 11.15,114.43 11.3,112.83 11.33,105.41 23.88,105.41 23.88,83.82 27.94,83.82 27.94,105.16 27.69,124.46 23.24,124.46 23.24,119.89 6.35,119.89 6.35,124.46
  pour Top (isolate 0.254, rank 2): 0,124.46 0,114.43 11.3,114.43 11.3,105.16 23.88,105.16 23.88,83.82 27.94,83.82 27.94,124.46 23.37,124.46 23.37,119.76 6.22,119.76 6.22,124.46
  pour Top (isolate 0.406): 13.54,124.43 16.05,124.43 16.05,120.55 13.54,120.55
  pour Bottom (isolate 0.406): 16.05,124.43 13.54,124.43 13.54,120.55 16.05,120.55
AMP+  (via drill 0.3)
  Top 0.254: R11.2 R7.1
  Top 0.813: R11.2 18.11,54.81 18.11,55.42
  other vias: 17.4,58.93 18.8,58.93 18.8,55.37 17.4,55.37 15.88,52.57
  pour Top (isolate 0.406): 19.1,59.16 19.1,55.27 17.12,55.27 17.12,59.16
  pour Bottom (isolate 0.406): 17.12,59.16 17.12,55.27 19.1,55.27 19.1,59.16
AMP+1  (via drill 0.3)
  other vias: 17.14,124.21 18.54,124.21 18.54,120.65 17.14,120.65
  pour Top: 18.85,124.43 18.85,120.55 16.87,120.55 16.87,124.43
  pour Bottom: 16.87,124.43 16.87,120.55 18.85,120.55 18.85,124.43
AMP-  (via drill 0.3)
  Top 0.813: R9.2 11.99,54.94 11.99,55.63
  Bottom 0.254: R8.1 R9.2
  other vias: 11.18,58.93 12.7,58.93 12.7,55.37 11.18,55.37 14.35,52.58
  pour Top (isolate 0.406): 12.98,59.16 12.98,55.27 11,55.27 11,59.16
  pour Bottom (isolate 0.406): 11,59.16 11,55.27 12.98,55.27 12.98,59.16
AMP-1  (via drill 0.3)
  other vias: 10.92,124.21 12.45,124.21 12.45,120.65 10.92,120.65
  pour Top: 12.73,124.43 12.73,120.55 10.74,120.55 10.74,124.43
  pour Bottom: 10.74,124.43 10.74,120.55 12.73,120.55 12.73,124.43
AVDD  (via drill 0.3)
  Top 0.508: U$2.24 11.68,105.66 12.19,105.16 17.27,105.16 | 17.27,105.16 21.84,105.16 25.91,101.09 25.91,88.9 J7.20 | 17.27,105.16 C22.2
  other vias: 17.27,106.1
D0
  Top 0.254: U1.16 8.16,17.81 8.13,17.78 8.13,5.33 J1.4
D1
  Top 0.254: U1.17 11.2,5.56 10.46,4.82 10.46,3 J1.5
D2
  Top 0.254: U1.18 11.7,4.34 J1.6
D3
  Top 0.254: U1.19 12.2,7.59 12.2,5.53 12.9,4.82 12.9,3.1 J1.7
D3V3  (via drill 0.25, 0.3)  (1 unrouted)
  Top 0.203: 11.7,24.22 11.41,24.51 11,24.51 8.74,24.51 C6.1 | R27.1 v9.14,43.11 | v6.35,43.16 R28.2
  Top 0.254: C6.1 C5.1 | R12.2 21.84,21.31 | 21.84,21.31 16.76,21.31 U1.32 | 21.84,21.31 21.79,21.36 C4.1 | 11.68,22.93 U1.7 11.7,24.43 v11.59,24.55
  Top 0.305: 17.65,27.41 J5.1 18.41,27.43 18.8,27.43 19.3,27.18 18.29,26.92 18.9,26.57 18.9,23.9 U1.32 | J5.2 20.19,27.41 21.44,26.17 21.44,24.99 20.07,23.62 19.08,23.62 16.76,21.31
  Top 0.406: v20.95,35.94 20.95,33.66
  Top 0.61: 21.01,32.38 21.01,29.01 J5.2 J5.1
  Bottom 0.203: R18.2 20.7,19.05 R1.2 19.25,20.07 19.3,20.07
  Bottom 0.254: U5.3 16.69,48.66 18.67,48.66 | 18.67,48.66 22.08,48.66 22.29,48.45 U2.6 22.29,47.05 21.59,46.35 21.4,46.35 21.38,46.33 20.68,46.33 20.39,46.04 U2.3 20.39,42.59 C17.1 | v6.35,43.16 6.35,44.02 | v9.14,43.11 9.14,44.02 | U3.2 21.98,21.78 C4.1 21.79,21.66 20.19,20.07 19.3,20.07 | C18.1 18.67,48.66 | 19.25,20.07 19.01,20.31 12.84,20.31 11.68,21.46 11.68,24.45 v11.59,24.55
  Bottom 0.406: J6.1 4.91,44.02 6.35,44.02 9.14,44.02 17.96,44.02 19.11,45.18 U2.3 20.39,36.51 v20.95,35.94
  other vias: 21.79,21.97
  pour Top: 20.45,34.54 21.59,34.54 21.59,30.23 20.45,30.23
  pour Top (isolate 0.406, no thermals): 16.26,21.34 19.05,24.13 20.57,24.13 17.78,21.34
D4
  Top 0.254: U1.22 13.7,7.5 14.5,6.7 14.5,6 14.22,5.72 J1.8
D5
  Top 0.254: U1.23 14.2,7.57 15.49,6.29 15.49,3.06 J1.9
D6
  Top 0.254: U1.24 14.7,7.65 16.76,5.59 J1.10
D7
  Top 0.254: U1.25 17.62,17.81 17.98,17.45 17.98,3.1 J1.11
D8
  Top 0.254: U1.26 16.39,18.23 17.78,18.23 19.3,16.7 J1.12
D9
  Top 0.254: U1.27 16.39,18.73 17.86,18.73 20.57,16.01 20.57,3.05 J1.13
DACCLK
  Top 0.305: U$2.28 6.6,103.38 4.06,100.84 4.06,87.38 J7.3
DACMODE
  Top 0.305: U$2.25 10.41,104.39 8.13,102.11 6.1,102.11 5.33,101.35 J7.4
DACSLEEP  (via drill 0.3)
  Top 0.305: U$2.15 v23.11,107.95
  Bottom 0.305: v23.11,107.95 J7.18
DD0
  Top 0.305: U$2.12 J7.16
DD1
  Top 0.305: U$2.11 19.3,87.38 J7.15
DD2
  Top 0.305: U$2.10 J7.14
DD3
  Top 0.305: U$2.9 16.76,87.38 J7.13
DD4
  Top 0.305: U$2.8 J7.12
DD5
  Top 0.305: U$2.7 14.22,87.38 J7.11
DD6
  Top 0.305: U$2.6 J7.10
DD7
  Top 0.305: U$2.5 11.68,87.38 J7.9
DD8
  Top 0.305: U$2.4 J7.8
DD9
  Top 0.305: U$2.3 9.14,87.38 J7.7
DD10
  Top 0.305: U$2.2 J7.6
DD11
  Top 0.305: U$2.1 6.6,87.38 J7.5
DGND  (via drill 0.3)
  Top 0.305: U$2.26 v9.14,107.7 | v5.99,90.68 5.99,89.76
  Top 0.406: v4.72,99.31 v4.72,90.17 | v5.99,96.77 v5.99,90.68
  Bottom 0.305: v9.14,107.7 9.33,107.51 C23.1 C24.1
  other vias: 11.43,104.14 12.7,104.14 13.97,104.14 15.24,104.14 16.51,104.14 17.78,104.14 19.05,104.14 20.32,104.14 21.59,104.14 22.35,103.38 22.35,102.11 10.67,103.38 9.91,102.62 9.14,102.11 8.38,103.63 9.14,104.39 9.65,113.54 8.64,113.54 7.62,113.54 6.6,113.54 5.59,113.54 4.57,113.54 3.56,113.54 2.54,113.54 1.52,113.54 12.19,103.38 13.46,103.38 14.73,103.38 16,103.38 17.27,103.38 18.54,103.38 19.81,103.38 21.08,103.38 11.43,102.62 12.95,102.62 14.22,102.62 15.49,102.62 16.76,102.62 18.03,102.62 19.3,102.62 20.57,102.62 21.59,102.62 10.67,102.11 12.19,102.11 13.72,102.11 14.99,102.11 16.26,102.11 17.53,102.11 18.8,102.11 20.07,102.11 21.34,96.77 22.35,96.77 21.34,95.76 22.35,95.76 21.34,94.74 22.35,94.74 21.34,93.73 22.35,93.73 21.34,92.71 22.35,92.71 21.34,91.69 22.35,91.69 21.34,90.68 22.35,90.68 21.84,89.92 8.38,104.39 8.38,105.16 9.14,105.16 1.52,112.52 2.54,112.52 3.56,112.52 4.57,112.52 5.59,112.52 5.99,96.01 5.99,95.25 5.99,94.49 5.99,93.73 5.99,92.96 5.99,92.2 5.99,91.44 4.72,90.93 4.72,91.69 4.72,92.46 4.72,93.22 4.72,93.98 4.72,94.74 4.72,95.5 4.72,96.27 4.72,97.03 4.72,97.79 4.72,98.55
  pour Top (isolate 0.406): 23.16,83.85 23.24,104.5 10.67,104.5 10.67,112.52 9.91,113.28 9.91,113.79 0.51,113.79 0.25,83.82
  pour Bottom (isolate 0.254, rank 2): 0.51,113.67 0.51,83.95 23.04,83.97 23.04,104.17 10.41,104.14 10.41,113.67
DVDD  (via drill 0.5)
  Top 0.508: U$2.27 7.87,105.92 v7.62,105.66
  Bottom 0.508: v7.62,105.66 C24.2 | C24.2 C23.2 | C24.2 7.62,103.63 2.79,98.81 J7.2
GND  (via drill 0.25, 0.3)  (3 unrouted)
  Top 0.203: v14.17,75.36 v14.17,74.47
  Top 0.254: C10.2 8.85,26.83 C9.2 | 11.18,23.88 11.18,22.94 U1.8 11.2,21.55 11.23,21.52 11.23,21.28 U1.EXP v12.95,18.8 | v0.76,17.27 0.76,17.14 2.29,17.14 | v3.68,17.27 3.68,18.29 | v3.68,25.4 2.29,25.4 | v3.68,23.37 3.68,24.38 | 10.03,23.62 10.03,23.57 C6.2 v7.62,23.57 C5.2 5.33,23.57 v5.33,23.62 | U$1.6 13.51,47.16 v13.46,47.12 v13.46,45.7 | 2.41,48.9 J6.4 | 12.45,39.5 12.86,39.5 U$1.8 12.86,43.05 12.06,43.05 | U$1.13 16.11,39.57 16.51,39.17 | 22.81,36.14 v22.86,36.2 | v16.14,73 15.75,73.01 C2.2 15.59,73.25 14.76,72.42 | U4.1 v17.44,72.83 v17.45,72.82 | C16.1 13.75,73.58 v14.17,73.58 | U$3.P$11 14.76,72.42 | 14.76,72.42 14.17,73 v14.17,73.58 | v14.17,73.58 v14.17,74.47 | IF-.GND3 9.4,62.59 9.4,58.42 | IF-.GND4 14.73,62.33 14.73,57.78 | IF+.GND3 21.01,58.37 21.46,57.91 | C4.2 20.57,22.03 20.57,22.1 | U3.1 23.73,19.81 23.62,19.81
  Top 0.406: v22.81,33.83 22.81,36.14 | v8.64,54.36 8.64,56.77 | v6.35,57.07 6.43,57.15 8.26,57.15 | v23.75,57.07 22.68,57.07 22.35,57.4 | v21.46,54.36 21.46,55.75 21.21,56.01 | v16,55.37 14.99,55.37 14.99,54.23
  Top 0.61: 2.29,17.14 2.29,15.24 | 3.68,18.29 5.21,18.29 | 2.29,25.4 2.29,27.05 | 3.68,24.38 5.21,24.38
  Bottom 0.203: R6.2 20.56,14.86 R20.1 | U$3.P$10 14.17,74.27 v14.17,74.47
  Bottom 0.254: U5.2 14.72,47.64 14.72,47.32 14.51,47.12 v13.46,47.12 4.19,47.12 J6.4 | v13.46,45.7 13.65,45.95 U5.6 | R10.2 2.41,48.9 | v16.14,73 16.15,72.61 U$3.P$7 | C1.2 19.12,73.73 18.03,72.64 17.63,72.64 v17.45,72.82 | v8.38,65.53 8.38,67.06 v7.11,67.06
  Bottom 0.305: 24.13,29.21 23.98,29.06 23.98,27.68 22.73,26.43 | 24.13,29.21 24.13,30.91 v22.81,30.91 | J4.4 25.27,26.43 24.03,27.68 24.03,28.71 24.13,28.81 24.13,29.21 | J4.3 22.73,26.43 | 21.59,28.81 21.49,28.71 21.49,27.68 | 21.59,29.21 21.59,28.81 | 22.73,26.43 21.49,27.68 | 21.59,28.81 22.1,29.32 22.1,29.72 | 21.49,27.68 21.49,26.95 J4.2 20.19,26.43 18.95,27.68 18.95,28.96 | 18.8,29.72 18.95,29.57 18.95,28.96 | J4.1 17.65,26.43 18.9,27.68 18.9,28.91 18.95,28.96
  Bottom 0.406: v6.35,57.07 7.42,57.07 7.49,57.15 | v8.64,54.36 8.64,56.13 | v21.46,54.36 21.46,56.01 | v23.75,57.07 22.15,57.07 22.1,57.02 | v14.1,55.37 14.99,55.37 14.99,54.1
  other vias: 0.76,25.4 0.76,23.37 0.76,19.3 3.68,19.3 22.81,32.31 12.95,19.56 6.35,58.93 6.35,55.24 23.75,58.93 23.75,55.24 14.1,58.8 16,58.8 14.81,72.36 14.1,78.74 14.99,77.98 15.88,78.74 14.17,62.89 9.09,62.89 15.93,62.89 21.01,62.89 2.41,66.4 2.41,71.48 2.41,73.2 2.41,78.28 9.09,81.28 14.17,81.28 15.93,81.28 21.01,81.28 20.63,21.97 23.79,19.88 15.49,29.46 15.49,28.45 15.49,27.43 15.49,26.42 15.49,25.4 16,25.91 15.49,24.38 12.95,74.68 7.62,78.49 12.19,74.93 11.68,75.44 10.67,75.44 10.16,75.95 9.65,76.45 9.14,76.96 11.18,74.93 8.64,77.47 8.13,77.98 8.89,78.23 8.38,78.74 9.14,78.99 7.62,79.25 7.62,80.01 7.62,80.77 7.62,81.53 7.62,82.3 7.62,83.06 11.68,74.42 12.45,74.17 12.45,73.41 22.61,79.76 22.61,80.52 22.61,81.28 22.61,82.04 22.61,82.8 23.37,79.76 23.37,80.52 23.37,81.28 23.37,82.04 23.37,82.8 24.13,79.76 24.13,80.52 24.13,81.28 24.13,82.04 24.13,82.8 24.89,79.76 24.89,80.52 24.89,81.28 24.89,82.04 24.89,82.8 25.65,79.76 25.65,80.52 25.65,81.28 25.65,82.04 25.65,82.8 26.42,79.76 26.42,80.52 26.42,81.28 26.42,82.04 26.42,82.8 27.18,79.76 27.18,80.52 27.18,81.28 27.18,82.04 27.18,82.8 22.61,77.47 22.61,78.23 22.61,78.99 22.61,76.71 23.37,76.71 24.13,76.71 23.37,77.47 23.37,78.23 23.37,78.99 24.13,77.47 24.13,78.23 24.13,78.99 24.89,77.47 24.89,78.23 24.89,78.99 25.65,77.47 25.65,78.23 25.65,78.99 26.42,77.47 26.42,78.23 26.42,78.99 27.18,77.47 27.18,78.23 27.18,78.99 27.18,76.71 27.18,75.95 0.76,80.01 0.76,80.77 0.76,81.53 0.76,82.3 0.76,83.06 1.52,80.01 1.52,80.77 1.52,81.53 1.52,82.3 1.52,83.06 2.29,80.01 2.29,80.77 2.29,81.53 2.29,82.3 2.29,83.06 3.05,80.01 3.05,80.77 3.05,81.53 3.05,82.3 3.05,83.06 3.81,80.01 3.81,80.77 3.81,81.53 3.81,82.3 3.81,83.06 4.57,80.01 4.57,80.77 4.57,81.53 4.57,82.3 4.57,83.06 5.33,80.01 5.33,80.77 5.33,81.53 5.33,82.3 5.33,83.06 6.1,80.01 6.1,80.77 6.1,81.53 6.1,82.3 6.1,83.06 6.86,80.01 6.86,80.77 6.86,81.53 6.86,82.3 6.86,83.06 7.37,77.72 4.95,79.3 12.19,76 12.7,75.49 21.08,77.22 21.08,75.69 21.08,78.74 21.08,76.45 21.84,77.22 21.84,77.98 21.84,78.74 21.84,76.45 20.32,76.45 20.32,75.69 20.32,74.93 19.56,75.69 19.56,74.93 18.8,74.93 18.03,74.93 18.03,75.69 18.54,74.17 17.27,74.42 17.27,75.18 16.13,73.84 16.13,74.45 16.13,75.06 16.71,74.8 22.35,63.5 22.35,64.26 22.35,65.02 22.35,65.79 22.35,66.55 23.11,63.5 23.11,64.26 23.11,65.02 23.11,65.79 23.11,66.55 23.88,63.5 23.88,64.26 23.88,65.02 23.88,65.79 23.88,66.55 24.64,63.5 24.64,64.26 24.64,65.02 24.64,65.79 24.64,66.55 25.4,63.5 25.4,64.26 25.4,65.02 25.4,65.79 25.4,66.55 26.16,63.5 26.16,64.26 26.16,65.02 26.16,65.79 26.16,66.55 22.35,61.21 22.35,61.98 22.35,62.74 23.11,61.21 23.11,61.98 23.11,62.74 23.88,61.21 23.88,61.98 23.88,62.74 24.64,61.21 24.64,61.98 24.64,62.74 25.4,61.21 25.4,61.98 25.4,62.74 26.16,61.21 26.16,61.98 26.16,62.74 20.07,67.31 20.07,68.07 20.83,67.31 20.83,68.07 21.59,67.31 21.59,68.07 22.35,67.31 22.35,68.07 23.11,67.31 23.11,68.07 23.88,67.31 23.88,68.07 20.07,68.83 20.07,69.6 20.83,68.83 20.83,69.6 21.59,68.83 21.59,69.6 22.35,68.83 22.35,69.6 23.11,68.83 23.11,69.6 23.88,68.83 23.88,69.6 21.59,66.55 21.59,65.79 19.3,69.6 18.54,69.6 17.78,69.6 17.02,69.6 19.3,68.83 18.54,68.83 17.78,68.83 19.3,68.07 18.54,68.07 19.3,67.31 21.34,72.39 22.1,73.15 22.35,72.39 22.86,73.91 23.62,74.68 23.11,73.15 23.88,73.91 23.37,72.39 24.13,73.15 24.64,74.68 5.08,73.91 5.84,73.91 6.6,73.91 7.37,73.91 8.13,73.15 5.08,72.39 5.84,72.39 6.6,72.39 7.37,72.39 6.6,73.15 7.37,73.15 8.13,72.39 8.89,72.39 5.08,73.15 5.84,73.15 5.08,71.63 5.08,70.87 5.84,71.63 5.84,70.87 6.6,71.63 7.37,71.63 8.13,71.63 7.37,70.87 6.6,70.87 13.46,70.1 12.95,69.6 12.45,69.09 11.94,68.58 11.43,68.07 10.92,67.56 10.41,67.06 7.62,64.52 7.62,63.75 7.62,62.99 7.62,62.23 7.62,61.47 6.86,61.47 6.1,61.47 5.33,61.47 4.57,61.47 5.33,62.23 6.1,62.23 6.86,62.23 6.86,62.99 6.86,63.75 6.1,62.99 0.76,61.47 1.52,61.47 0.76,62.23 0.76,62.99 0.76,63.75 0.76,64.52 1.52,62.23 1.52,62.99 1.52,63.75 1.52,64.52 2.29,64.52 2.29,63.75 2.29,62.99 2.29,62.23 3.05,62.99 3.05,63.75 3.05,64.52 3.81,64.52 3.81,63.75 4.57,64.52 5.08,65.28 4.19,65.07 3.43,65.07 2.67,65.07 1.91,65.07 1.14,65.07 14.99,78.74 13.72,65.53 14.73,65.53 15.49,65.53 16.51,65.53 14.22,66.04 16,66.04 15.11,66.07 14.68,66.6 15.52,66.6 15.09,67.11 13.46,74.17 11.43,33.27 10.67,33.78 9.91,34.04 9.14,33.78 11.43,32.51 10.67,33.02 9.91,33.27 9.14,33.02 17.27,34.04 18.03,34.29 18.8,34.04 19.56,34.29 17.27,33.27 18.03,33.53 18.8,33.27 19.56,33.53 16,28.96 16,27.94 16,26.92 16,24.89 15.49,23.37 16,23.88 15.75,22.61 16.21,23.19 16.51,30.48 16.51,31.24 16.51,32 17.27,32.51 17.27,31.75 17.27,30.99 11.43,30.99 11.43,31.75 12.09,32.16 13.41,29.44 11.43,29.46 11.43,30.23 12.7,26.67 10.92,27.43 10.92,28.19 10.16,27.94 9.4,27.94 8.64,27.94 10.67,29.97 10.67,30.73 10.67,31.5 10.67,32.26 18.03,31.24 18.03,32.77 18.03,32 9.91,32.51 12.09,31.39 12.09,30.63 12.09,29.87 10.92,26.16 10.92,25.4 10.16,25.4 10.41,23.62 10.41,22.86 9.65,23.37 9.65,22.61 10.41,22.1 8.89,22.61 8.13,22.61 7.39,22.71 6.6,22.76 5.64,22.91 4.8,23.09 4.8,24.1 5.56,24.36 4.8,24.87 5.56,25.12 4.8,25.63 5.56,25.88 4.8,26.39 6.32,25.88 7.09,25.88 7.85,25.88 8.61,25.88 9.4,25.76 5.56,26.64 6.32,26.64 7.09,26.64 7.85,26.64 16.51,24.38 16.79,23.67 17.78,23.62 17.27,24.21 12.34,36.14 12.7,36.83 11.94,36.83 11.43,37.85 11.43,38.61 11.43,39.37 12.7,39.12 12.19,39.88 11.43,40.13 16.51,36.07 16.26,36.83 17.02,36.83 17.78,36.07 17.78,36.83 17.78,37.59 17.78,38.35 17.78,39.12 17.02,39.12 16.26,39.12 17.78,39.88 18.54,40.13 18.54,39.37 18.54,38.61 18.54,37.85 18.54,37.08 18.54,36.32 19.3,36.58 19.3,37.34 19.3,38.1 19.3,38.86 19.3,39.62 16.51,29.72 17.27,30.23 18.03,30.48 18.03,29.72 18.8,32.51 18.8,31.75 18.8,30.99 18.8,30.23 18.8,29.46 19.56,32.77 19.56,32 19.56,31.24 19.56,30.48 19.56,29.72 10.67,36.83 9.91,36.32 10.67,37.59 10.67,38.35 10.67,39.12 10.67,39.88 11.43,36.32 9.91,37.08 9.91,37.85 9.91,38.61 9.91,39.37 9.91,40.13 19.3,40.39 9.91,40.89 10.67,40.64 9.91,41.66 10.67,41.4 9.91,42.42 10.67,42.16 10.67,42.93 11.43,42.42 11.43,41.66 11.43,40.89 12.19,40.64 12.19,41.4 12.19,42.16 17.78,40.64 18.54,40.89 19.3,41.15 19.3,41.91 18.54,41.66 17.78,41.4 17.78,42.16 18.54,42.42 19.3,42.93 18.54,43.18 17.78,42.93 14.1,54.48 14.61,53.98 15.62,53.98 16.13,54.48 15.11,54.48 15.11,53.47 11.05,54.48 11.56,53.98 12.06,53.47 12.57,52.96 13.08,52.45 11.81,52.7 11.3,53.21 10.79,52.7 10.79,53.72 10.29,54.48 10.29,53.21 9.78,53.72 9.53,54.48 17.4,52.7 17.91,53.21 18.41,53.72 18.92,54.23 18.41,52.7 18.92,53.21 19.43,53.72 19.68,54.48 20.45,54.48 20.45,53.72 19.94,53.21 13.51,50.52 13.51,49.76 13.51,49 17.63,50.39 17.65,49.63 18.64,50.01 9.91,31.75 9.91,30.99 9.91,30.23 11.43,34.04 9.14,32.26 9.14,31.5 9.14,30.73 9.14,29.97 8.38,34.29 8.38,33.53 8.38,32.77 8.38,32 8.38,31.24 8.38,30.48 9.14,36.83 8.38,36.32 9.14,37.59 9.14,38.35 9.14,39.12 9.14,39.88 9.14,40.64 9.14,41.4 9.14,42.16 11.25,37.16 11.43,43.18 8.38,37.08 8.38,37.85 8.38,38.61 8.38,39.37 8.38,40.13 8.38,40.89 8.38,41.66 8.38,42.42 7.85,27.41 7.85,28.17 7.85,28.93 7.85,29.69 7.59,30.45
  pour Top: 0.13,22.86 0.13,25.91 4.19,25.91 4.19,22.86
  pour Top (no thermals): 0.13,16.76 0.13,19.81 4.19,19.81 4.19,16.76
  pour Top: 22.23,34.54 23.37,34.54 23.37,30.23 22.23,30.23
  pour Top (isolate 0.406, rank 2): 0.25,34.42 12.7,34.39 12.7,29.54 13.54,29.54 13.46,21.97 15.42,21.95 15.42,29.54 16.18,29.54 16.18,34.42 21.59,34.42 21.59,29.84 24,29.84 24,34.42 27.69,34.42 27.69,0.38 0.25,0.38 0.25,16.38 4.57,16.38 4.57,19.94 10.92,20.19 10.92,17.65 14.99,17.65 14.99,21.46 11.3,21.46 11.28,21.87 4.6,22.89 4.57,26.29 0.25,26.29
  pour Bottom (isolate 0.305, rank 2): 17.14,34.54 27.69,34.54 27.69,0.38 0.38,0.38 0.33,16.28 0.3,16.33 4.65,16.31 4.62,19.89 11.05,20.17 11.13,21.97 4.67,22.96 4.65,26.34 0.25,26.37 0.25,34.54 12.62,34.49 12.7,34.49 12.73,29.49 13.51,29.49 13.54,21.29 15.52,21.34 15.49,29.46 16.26,29.46 16.26,32.51 17.14,32.51
  pour Top (isolate 0.406): 10.19,59.16 10.19,55.27 7.24,55.27 7.24,59.16
  pour Top (isolate 0.406): 13.79,59.16 16.31,59.16 16.31,55.27 13.79,55.27
  pour Top (isolate 0.406): 22.89,59.16 22.89,55.27 19.94,55.27 19.94,59.16
  pour Bottom (isolate 0.406): 16.31,59.16 13.79,59.16 13.79,55.27 16.31,55.27
  pour Bottom (isolate 0.305): 7.24,59.16 7.24,55.27 10.19,55.27 10.19,59.16
  pour Bottom (isolate 0.406): 19.94,59.16 19.94,55.27 22.89,55.27 22.89,59.16
  pour Top (isolate 0.406): 0.38,35.94 12.83,35.94 12.83,43.81 16.13,43.81 16.13,36.22 16.13,35.94 18.54,35.94 27.69,35.94 27.69,37.08 27.69,59.18 23.5,59.18 23.5,54.61 7.49,54.61 6.6,54.61 6.6,59.18 0.38,59.18
  pour Bottom (isolate 0.305): 0.38,59.18 0.38,35.94 12.83,35.94 12.83,43.94 15.24,43.94 16.13,43.94 16.13,35.81 27.69,35.81 27.69,59.18 23.5,59.18 23.5,54.74 23.5,54.61 6.73,54.61 6.6,54.61 6.6,59.18
  pour Top (isolate 0.305): 0.38,67.18 0.38,60.83 9.91,60.83 9.91,66.04 13.72,69.85 13.97,70.1 13.97,71.12 13.97,71.25 12.32,71.25 8.26,67.18
  pour Top (isolate 0.406): 0.38,74.04 8,74.04 9.53,72.52 9.65,72.39 8,70.74 0.38,70.74
  pour Top (isolate 0.305): 0.38,77.47 0.38,83.31 9.91,83.31 9.91,78.49 13.34,75.06 14.22,75.06 14.22,73.41 12.32,73.41 12.32,73.79 8.64,77.47
  pour Top (isolate 0.406): 13.46,83.31 13.46,79.12 14.86,77.72 15.11,77.72 16.64,79.25 16.64,83.31
  pour Top (isolate 0.406): 20.32,83.19 20.32,78.54 17.02,75.18 16,75.18 16,70.23 20.32,65.91 20.32,60.96 27.56,60.96 27.56,83.19
  pour Bottom (isolate 0.406): 0.51,83.31 0.51,77.47 8.64,77.47 12.19,73.91 12.19,73.41 14.22,73.41 14.22,75.18 13.21,75.18 9.91,78.49 9.91,83.31
  pour Bottom (isolate 0.305): 20.32,83.19 20.32,78.51 17.53,75.69 17.02,75.18 16,75.18 16,70.23 20.32,65.91 20.32,60.96 27.43,60.96 27.56,83.19
  pour Bottom (isolate 0.406): 0.38,70.74 8,70.74 9.53,72.26 9.65,72.39 8,74.04 0.38,74.04
  pour Bottom (isolate 0.406): 16.51,83.31 16.51,79.12 15.11,77.72 14.86,77.72 13.34,79.25 13.34,83.31
  pour Bottom (isolate 0.305): 0.51,83.31 0.51,77.47 8.64,77.47 12.19,73.91 12.19,73.41 14.22,73.41 14.22,75.18 13.21,75.18 9.91,78.49 9.91,83.31
  pour Bottom (isolate 0.406, no thermals): 0.43,19.84 4.22,19.84 4.22,16.74 0.43,16.74
  pour Bottom (isolate 0.406, no thermals): 0.43,25.93 4.22,25.93 4.22,22.83 0.43,22.83
  pour Bottom (isolate 0.305, rank 2): 16.76,60.96 13.46,60.96 13.46,65.79 14.99,67.31 15.24,67.31 16.76,65.79
  pour Top (isolate 0.305, rank 2): 13.46,60.96 16.76,60.96 16.76,65.79 15.24,67.31 14.99,67.31 13.46,65.79
  pour Bottom (isolate 0.305): 0.51,60.96 0.51,67.18 8.64,67.18 13.08,71.63 14.1,71.63 14.1,70.23 9.91,66.04 9.91,60.83 0.64,60.83
IN+
  Bottom 0.305: L1.2 L5.2
  pour Bottom (isolate 0.406, no thermals): 11.43,79.88 10.92,79.38 10.92,79.27 11.91,78.03 12.55,78.69 12.32,79.38
IN-
  Bottom 0.305: L2.2 L4.2
  pour Bottom (isolate 0.406, no thermals): 18.54,80.01 19.18,79.27 18.19,78.03 17.53,78.66 17.88,79.55
IOUT1
  Top 0.508: 15.49,116.69 U$5.P$2
  Top 0.61: U$5.P$2 17.53,118.82 17.53,119.63
  Top 0.813: U$2.21 15.49,116.69
  pour Top (no thermals): 17.88,119.99 17.17,119.99 17.17,119.2 17.88,119.2
IOUT2
  Top 0.508: 14.22,116.71 U$5.P$1
  Top 0.61: U$5.P$1 12.37,118.69 12.37,119.74
  Top 0.813: U$2.22 14.22,116.71
  pour Top (no thermals): 12.7,119.96 11.99,119.96 11.99,119.18 12.7,119.18
LO+
  Bottom 0.305: C12.2 8.15,75.74 7.67,75.74 | 7.67,75.74 LO+.ANT | R26.2 7.67,75.74
  pour Bottom (isolate 0.305, no thermals): 3.43,75.82 3.96,76.35 4.45,76.35 8.15,75.74 4.45,75.13
LO-
  Bottom 0.305: C11.1 8.23,68.94 7.64,68.94 | 7.64,68.94 LO-.ANT | R25.2 7.64,68.94
  pour Bottom (isolate 0.305, no thermals): 3.43,69.09 3.89,69.55 4.42,69.55 8.23,68.94 4.42,68.33
MIX_EN  (via drill 0.25)
  Top 0.254: v14.22,70.73 14.34,70.61 25.4,70.61 J3.2
  Bottom 0.254: U$3.P$3 14.22,70.55 v14.22,70.73
N98
  Bottom 0.254: U$3.P$9 14.81,75.77 14.28,76.3 14.28,76.31 L1.1
N$1
  Top 0.254: U$1.3 15.46,51 R11.1 17.29,51.42 R14.1
N$3  (via drill 0.3)
  Top 0.305: U$2.17 v20.57,108.2
  Bottom 0.305: v20.57,108.2 21.52,107.26 C15.1
N$4  (via drill 0.3)
  Top 0.305: U$2.18 v19.3,107.95
  Bottom 0.305: v19.3,107.95 19.56,107.7 R21.1
N$6  (via drill 0.3)
  Top 0.305: U$2.23 v12.95,108.2
  Bottom 0.305: v12.95,108.2 C21.2
N$7  (via drill 0.3)
  Top 0.305: U$2.19 18.03,108.2 v17.53,107.7
  Bottom 0.305: v17.53,107.7 17.27,107.44 C22.1
N$8  (via drill 0.3)
  Top 0.254: v17.37,116.46 16.76,116.46 16.76,116.59
  Bottom 0.203: U$4.2 v17.37,116.46
  Bottom 0.254: 15.31,109.8 C27.2
  Bottom 0.305: R24.2 17.02,111.51 | 17.02,111.51 18.8,113.28 18.8,115.8 18.8,116.1 18.36,116.53 17.45,116.53 v17.37,116.46 | 17.02,111.51 15.31,109.8
  pour Top (isolate 0.254): 16.36,116.69 16.36,115.98 17.02,115.98 17.02,116.69
N$11
  Top 0.254: U$1.4 14.81,50.96 R9.1 12.94,51.42 R15.1
N$20
  Bottom 0.254: U$3.P$2 11.41,72.11
  Bottom 0.305: 11.41,72.11 C11.2
N$21
  Top 0.203: C10.1 10.22,28.78 12.75,28.78 13.31,28.22 C7.1 13.31,25.65 | 13.31,25.65 C8.1 | U1.4 13.2,24.64 | 13.2,24.64 13.2,25.65 13.31,25.65 | U1.3 13.7,24.64 13.2,24.64
N$22
  Bottom 0.203: R20.2 21.84,16.37 R19.1 19.25,16.37 R5.2
N$23
  Top 0.203: 12.2,24.64 12.2,25.56 C8.2 12.15,26.8 | 12.15,26.8 C7.2 | C9.1 9.88,26.8 12.15,26.8 | U1.6 12.2,24.64 | U1.5 12.7,24.64 12.2,24.64
N$24
  Bottom 0.254: U$3.P$1 11.41,72.61
  Bottom 0.305: 11.41,72.61 C12.1
N$25
  Bottom 0.254: U$3.P$8 15.31,75.76 16.29,76.74 L2.1
N$26
  Bottom 0.254: U$3.P$4 14.81,69.09 14.17,68.45 C14.1
N$27
  Bottom 0.254: U$3.P$5 15.31,69.07 15.93,68.45 C13.1
N$30
  Bottom 0.203: 20.7,17.65 R19.2 | R18.1 21.86,17.53 R19.2 | R2.2 19.25,17.53 R19.2
OEN
  Top 0.254: U1.11 9.52,20.23 8.14,20.23 7.72,19.81 7.72,5.17 7.92,4.96 7.92,3.81 9.14,2.59 J1.3
OF
  Top 0.254: U1.28 16.39,19.23 17.93,19.23 21.84,15.31 J1.14
OUT+
  Bottom 0.254: 18.47,65.84 18.47,65.79
  Bottom 0.406: 18.47,65.79 18.47,66.06 L8.2 18.38,66.37
  Bottom 0.813: IF+.ANT 18.47,65.79 | C13.2 18.47,65.84
OUT-
  Bottom 0.254: 11.63,65.89 11.63,65.87
  Bottom 0.406: 11.63,65.87 L9.1 11.72,66.4
  Bottom 0.813: IF-.ANT 11.63,65.87 | C14.2 11.63,65.89
OVDD  (via drill 0.3)
  Top 0.254: U1.21 13.2,6.99 v13.72,6.48
  Bottom 0.254: v13.72,6.48 14.1,6.1 22.61,6.1 J1.16
OVSS  (via drill 0.3)
  Top 0.254: U1.20 12.7,6.63 v12.89,6.45
  Bottom 0.254: J1.15 24.26,1.78 22.99,3.05 16.29,3.05 15.49,3.85 15.49,4.98 14.94,5.54 13.8,5.54 v12.89,6.45
SCL  (via drill 0.3)
  Top 0.254: R27.2 v9.14,45.36
  Bottom 0.254: U5.5 15.11,44.96 15.49,44.58 | J6.2 2.9,44.56 9.14,44.56 | 9.14,44.56 14.55,44.56 14.57,44.58 15.49,44.58 | 15.49,44.58 15.65,44.58 15.67,44.56 17.73,44.56 19.91,46.74 21.21,46.74 21.34,46.86 U2.5 | v9.14,45.36 9.14,44.56
SDA  (via drill 0.3)
  Top 0.254: R28.1 v6.35,45.85
  Bottom 0.254: J6.3 6.48,46.48 | 6.48,46.48 15.75,46.48 | U5.4 16.06,46.17 15.75,46.48 | 15.75,46.48 19.09,46.48 U2.4 | v6.35,45.85 6.35,46.35 6.48,46.48
SMP_CLK  (via drill 0.3)
  Top 0.254: U1.9 7.34,21.31 5.97,19.94 5.97,4.95 J1.2
  other vias: 0.89,21.34 1.91,21.34 2.92,21.34 3.94,21.34
  pour Top (no thermals): 0.13,22.1 4.19,22.1 8.38,21.34 4.19,20.57 0.13,20.57
  pour Bottom (no thermals): 4.19,22.1 0.13,22.1 0.13,20.57 4.19,20.57
VBAT  (via drill 0.3)
  Top 0.254: v20.16,72.56 21.31,74.06
  Top 0.406: 24.64,36.2 24.64,34.29
  Top 0.508: 24.64,30.86 24.64,28.83 J5.4 J5.3
  Top 0.813: 24.64,36.2 24.64,42.8 27.18,45.34 27.18,74.17 J3.4 23.07,75.82 21.31,74.06 U4.3
  Bottom 0.254: C1.1 v20.16,72.56
  Bottom 0.813: J2.2 20.08,9.29 25.78,14.99 25.78,16.95 C3.1 25.85,20.69 U3.3 25.99,23.32 26.77,24.11 26.77,26.7 J5.4
  pour Top: 24,34.54 25.15,34.54 25.15,30.23 24,30.23
VC_CTRL  (via drill 0.3)
  Top 0.254: v22.35,44.07 17.53,44.07 16.76,43.3 U$1.14
  Bottom 0.254: U2.1 22.29,44.13 v22.35,44.07
VCM  (via drill 0.3)
  Top 0.254: U1.31 19.48,20.81 | 19.48,20.81 20.45,20.81 R13.1 | U$1.12 15.46,39.53 v15.49,39.5 | v19.56,20.73 19.48,20.81
  Bottom 0.254: v15.49,39.5 14.48,39.5 | v19.56,20.73 14.48,20.73 14.48,31.62 | 14.48,39.5 14.48,37.59 | 14.48,37.59 14.61,37.59 | 14.48,37.59 14.48,33.78 | C20.1 14.48,40.02 14.48,39.5
  pour Bottom: 13.97,31.24 14.99,31.24 14.99,34.54 13.97,34.54
  pour Bottom: 13.97,35.81 14.99,35.81 14.99,38.23 13.97,38.23
VGC  (via drill 0.3)
  Top 0.203: U$1.5 U5.1
  Bottom 0.254: C19.1 11.67,48.04 U5.1
  other vias: 14.16,48.04
VOUTAMP  (via drill 0.3)
  Top 0.305: v11.18,115.19 11.18,119.63
  Bottom 0.203: U$4.6 11.68,115.19 11.58,115.19 11.58,115.09
  Bottom 0.254: 11.05,115.19 v11.18,115.19 | v11.18,115.19 11.68,115.19 | 14.41,109.55 C27.1 | U$4.6 v11.18,115.19
  Bottom 0.305: R24.1 12.45,111.51 | 12.45,111.51 10.41,113.54 10.41,114.55 11.05,115.19 | 12.45,111.51 14.41,109.55
  pour Top (no thermals): 11.43,119.96 10.72,119.96 10.72,119.18 11.43,119.18
VS+  (via drill 0.3)  (1 unrouted)
  Top 0.406: v10.33,116.53 C25.2 9.83,115.24 9.14,114.55 2.79,114.55 2.03,115.32 2.03,117.86 J8.1
  Bottom 0.254: U$4.7 9.9,116.46 v10.33,116.53
VS-  (via drill 0.3)
  Top 0.254: v18.11,113.92 18.11,113.97 | 19.3,113.97 v19.56,113.97
  Top 0.406: 18.11,113.97 19.3,113.97 C26.2
  Bottom 0.254: U$4.4 v18.11,113.92
  Bottom 0.406: 8.15,119.08 8.1,119.13 | 8.15,119.08 18.39,119.08 19.43,118.03 19.43,114.1 v19.56,113.97 | 8.15,119.08 6.4,119.08 2.29,123.19 J9.1
(copper drawn outside any net)
  shapes: Top area x2

### Text on the board
tStop: FB
tDocu: V+ | AGND | V- | AMP OUT/DIFF- | DIFF+ | DV | CK | 10 | 8 | 6 | 4 | 2 | 0 | AV | SLP | 9 | 7 | 5 | 3 | 1 | DG | MD | 11 | NC | AG | VBAT | A3V3 | EN | GND | - | + | + | - | - | + | DVDD | VBAT | Range / Select | 0.5 | 1.0 | D0 | D2 | D4 | D6 | D8 | OF | OV | CLK | SD | EN | D3 | D1 | D5 | D7 | D9 | OG
bDocu: VCM